# Altium schematic sheet Sheet2.SchDoc
size A4; SheetNumber: 1; SheetTotal: 1
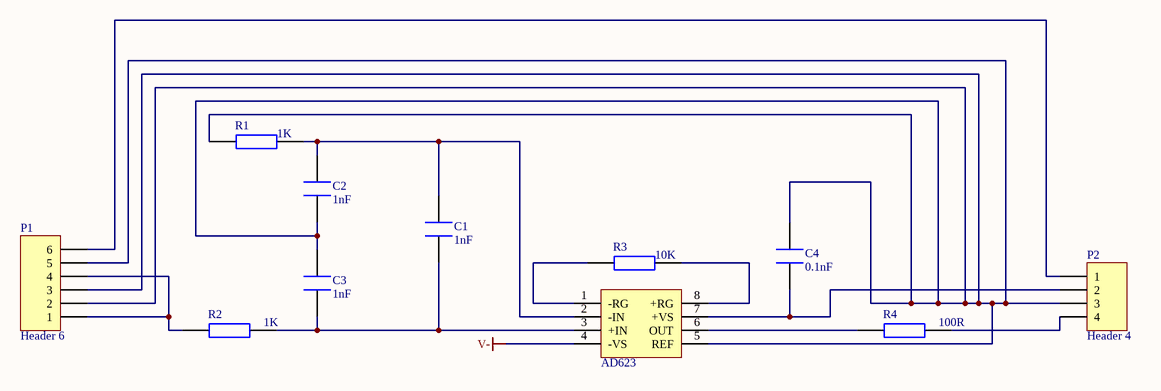
[diagram p0: Sheet2.SchDoc]

## Parts
C1  1nF  [0402]
C2  1nF  [0402]
C3  1nF  [0402]
C4  0.1nF  [0402]
IC1  AD623  [SO8_M]
P1  Header 6  [软排线6p]
P2  Header 4  [软排线4p]
R1  1K  [0402-A]
R2  1K  [0402-A]
R3  10K  [0402-A]
R4  100R  [0402-A]

## Nets
V-: IC1.4(-VS)
NetC1_1: C1.1 C3.1 IC1.3(+IN) R2.2
NetC1_2: C1.2 C2.2 IC1.2(-IN) R1.2
NetC2_1: C2.1 C3.2 C4.2 IC1.5(REF) P1.2 P1.3 P1.5 P2.3 R1.1
NetC4_1: C4.1 IC1.7(+VS) P2.2
NetIC1_1: IC1.1(-RG) R3.1
NetIC1_6: IC1.6(OUT) R4.1
NetIC1_8: IC1.8(+RG) R3.2
NetP1_1: P1.1 P1.4 R2.1
NetP1_6: P1.6 P2.1
NetP2_4: P2.4 R4.2

## Library data of the parts
C1-C4 = CAP: 电容
IC1 = AD623: IC
P1 = Header 6: Header, 6-Pin; LatestRevisionDate: 17-Jul-2002; LatestRevisionNote: Re-released for DXP Platform.; Publisher: Altium Limited
P2 = Header 4: Header, 4-Pin; LatestRevisionDate: 17-Jul-2002; LatestRevisionNote: Re-released for DXP Platform.; Publisher: Altium Limited
R1-R4 = RES: 电阻